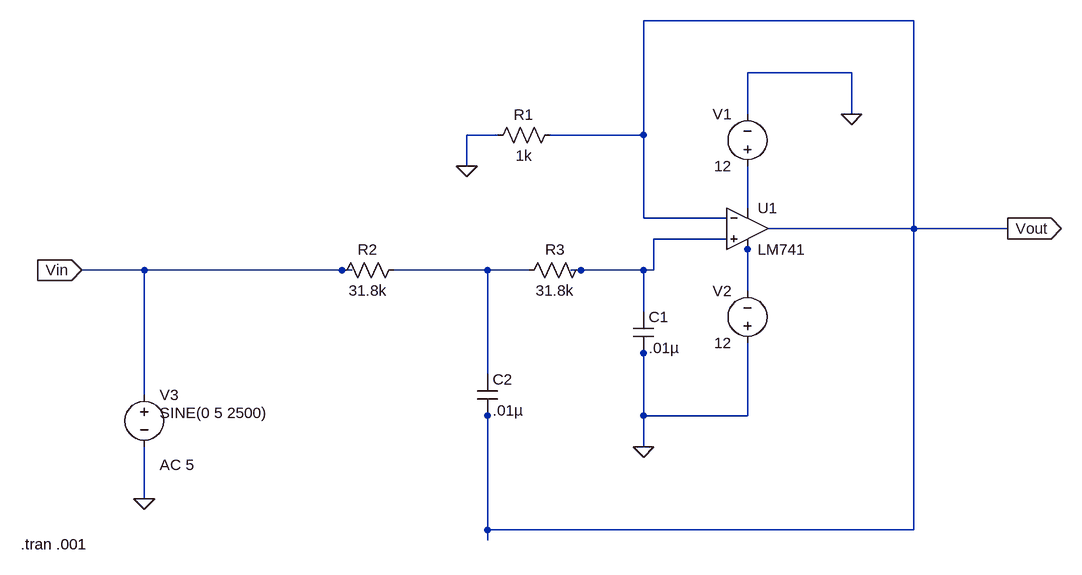
[diagram p0: schematic fianl.asc]
fianl.asc, the LTspice schematic file:
Version 4
SHEET 1 880 680
WIRE 480 -144 64 -144
WIRE 384 -64 224 -64
WIRE 224 0 224 -64
WIRE 384 0 384 -64
WIRE -160 32 -208 32
WIRE 64 32 64 -144
WIRE 64 32 -80 32
WIRE -208 80 -208 32
WIRE 224 144 224 80
WIRE 64 160 64 32
WIRE 192 160 64 160
WIRE 480 176 480 -144
WIRE 480 176 256 176
WIRE 624 176 480 176
WIRE 192 192 80 192
WIRE 224 208 224 192
WIRE -704 240 -800 240
WIRE -400 240 -704 240
WIRE -384 240 -400 240
WIRE -176 240 -320 240
WIRE -112 240 -176 240
WIRE -32 240 -48 240
WIRE 64 240 -32 240
WIRE 80 240 80 192
WIRE 80 240 64 240
WIRE 224 272 224 208
WIRE 64 304 64 240
WIRE 64 368 64 352
WIRE -176 400 -176 240
WIRE -704 432 -704 240
WIRE -176 464 -176 448
WIRE 64 464 64 368
WIRE 224 464 224 352
WIRE 224 464 64 464
WIRE 64 512 64 464
WIRE -704 592 -704 512
WIRE -176 640 -176 464
WIRE 480 640 480 176
WIRE 480 640 -176 640
WIRE -176 656 -176 640
FLAG 384 0 0
FLAG -208 80 0
FLAG 64 512 0
FLAG -704 592 0
FLAG 624 176 Vout
IOPIN 624 176 Out
FLAG -800 240 Vin
IOPIN -800 240 In
SYMBOL LM741 224 112 R0
SYMATTR InstName U1
SYMBOL voltage 224 96 R180
WINDOW 0 24 96 Left 2
WINDOW 3 24 16 Left 2
WINDOW 123 0 0 Left 0
WINDOW 39 0 0 Left 0
SYMATTR InstName V1
SYMATTR Value 12
SYMBOL voltage 224 368 R180
WINDOW 0 24 96 Left 2
WINDOW 3 24 16 Left 2
WINDOW 123 0 0 Left 0
WINDOW 39 0 0 Left 0
SYMATTR InstName V2
SYMATTR Value 12
SYMBOL res -64 16 R90
WINDOW 0 0 56 VBottom 2
WINDOW 3 32 56 VTop 2
SYMATTR InstName R1
SYMATTR Value 1k
SYMBOL cap 48 304 R0
SYMATTR InstName C1
SYMATTR Value .01µ
SYMBOL res -304 224 R90
WINDOW 0 0 56 VBottom 2
WINDOW 3 32 56 VTop 2
SYMATTR InstName R2
SYMATTR Value 31.8k
SYMBOL res -16 224 R90
WINDOW 0 0 56 VBottom 2
WINDOW 3 32 56 VTop 2
SYMATTR InstName R3
SYMATTR Value 31.8k
SYMBOL cap -192 400 R0
SYMATTR InstName C2
SYMATTR Value .01µ
SYMBOL voltage -704 416 R0
WINDOW 123 24 124 Left 2
WINDOW 39 0 0 Left 0
WINDOW 3 24 44 Left 2
SYMATTR Value2 AC 5
SYMATTR InstName V3
SYMATTR Value SINE(0 5 2500)
TEXT -894 662 Left 2 !.tran .001

The netlist it stands for:
* fianl.asc
XU1 N002 Vout N001 N003 Vout LM741  ; pins In+ In- V+ V- OUT
V1 N001 0 12
V2 0 N003 12
R1 Vout 0 1k
C1 N002 0 .01µ
R2 N004 Vin 31.8k
R3 N002 N004 31.8k
C2 N004 Vout .01µ
V3 Vin 0 SINE(0 5 2500) AC 5
.tran .001
.lib LM741.lib
.backanno
.end